# EAGLE design MoodBadge (EAGLE 8.1.0)
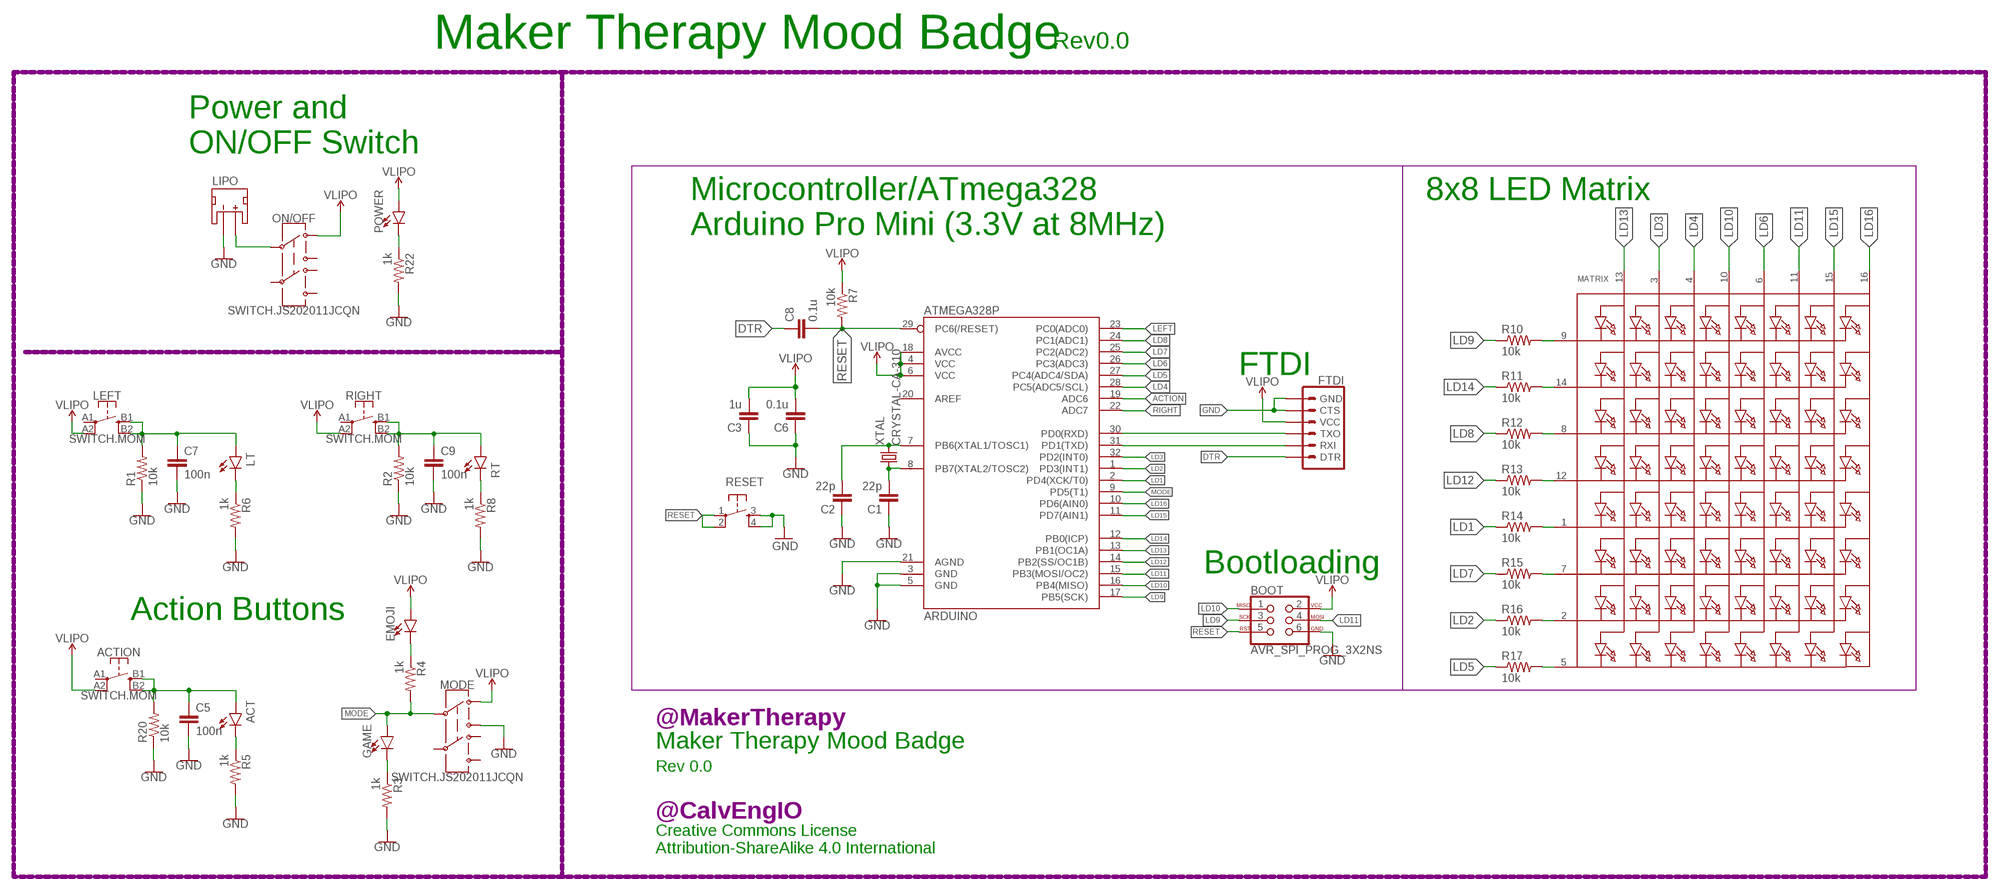
[diagram p0: schematic, sheet 1]

## Parts
ACT  LED0603  [LED-0603]
ACTION  SWITCH.MOM  [TACTILE_SWITCH_SMD_6.2MM_TALL]
ARDUINO  ATMEGA328P  ATMEGA328_SMT-OHMOD  [TQFP32-08]
BOOT  AVR_SPI_PROG_3X2NS  [2X3-NS]
C1  22p  CAPACITOR0402  [C0402]
C2  22p  CAPACITOR0402  [C0402]
C3  1u  CAPACITOR0402  [C0402]
C5  100n  CAPACITOR0402  [C0402]
C6  0.1u  CAPACITOR0402  [C0402]
C7  100n  CAPACITOR0402  [C0402]
C8  0.1u  C-EUC0402  [C0402]
C9  100n  CAPACITOR0402  [C0402]
EMOJI  LED0603  [LED-0603]
FTDI  6_PIN_SERIAL_TARGETSILK  [6_PIN_SERIAL_TARGET_SIDE_W_SILK]
GAME  LED0603  [LED-0603]
LEFT  SWITCH.MOM  [TACTILE_SWITCH_SMD_6.2MM_TALL]
LIPO  JST_2MM_MALE  [JST-2-SMD]
LT  LED0603  [LED-0603]
MATRIX  SEGMENT_8X8_ROWCATHODEM12A881UR  [SEGMENT_BL-M12A881UR]
MODE  SWITCH.JS202011JCQN  [SWITCH.00]
ON/OFF  SWITCH.JS202011JCQN  [SWITCH.00]
POWER  LED5MM  [LED_5MM]
R1  10k  RESISTOR0402  [R0402]
R2  10k  RESISTOR0402  [R0402]
R3  1k  RESISTOR0402  [R0402]
R4  1k  RESISTOR0402  [R0402]
R5  1k  RESISTOR0402  [R0402]
R6  1k  RESISTOR0402  [R0402]
R7  10k  RESISTOR0402  [R0402]
R8  1k  RESISTOR0402  [R0402]
R10  10k  RESISTOR0402  [R0402]
R11  10k  RESISTOR0402  [R0402]
R12  10k  RESISTOR0402  [R0402]
R13  10k  RESISTOR0402  [R0402]
R14  10k  RESISTOR0402  [R0402]
R15  10k  RESISTOR0402  [R0402]
R16  10k  RESISTOR0402  [R0402]
R17  10k  RESISTOR0402  [R0402]
R20  10k  RESISTOR0402  [R0402]
R22  1k  RESISTOR0402  [R0402]
RESET  BUTTON-PTS830GG140  [BUTTON-GULLWING]
RIGHT  SWITCH.MOM  [TACTILE_SWITCH_SMD_6.2MM_TALL]
RT  LED0603  [LED-0603]
U$8  CALVENGIO_HANDLEHANDLE.05  [CALVENGIO_HANDLE.05]
U$10  MAKERTHERAPY.HANDLEMAKERTHERAPY.HANDLE.175  [MAKERTHERAPY.HANDLE.175]
XTAL  CRYSTAL-CA-310  [CA-301]

## Nets
ACTION: ACT.A ACTION.B1 ACTION.B2 ARDUINO.19(ADC6) C5.1 R20.2
DTR: C8.1 FTDI.P$1(DTR)
GND: ARDUINO.3(GND) ARDUINO.5(GND) ARDUINO.21(AGND) BOOT.6 C1.1 C2.1 C3.1 C5.2 C6.1 C7.2 C9.2 FTDI.P$5(CTS) FTDI.P$6(GND) LIPO.1(-) MODE.3 R1.1 R2.1 R3.2 R5.2 R6.2 R8.2 R20.1 R22.2 RESET.3 RESET.4
LD1: ARDUINO.2(PD4(XCK/T0)) R14.1
LD2: ARDUINO.1(PD3(INT1)) R16.1
LD3: ARDUINO.32(PD2(INT0)) MATRIX.3(A2)
LD4: ARDUINO.28(PC5(ADC5/SCL)) MATRIX.4(A3)
LD5: ARDUINO.27(PC4(ADC4/SDA)) R17.1
LD6: ARDUINO.26(PC3(ADC3)) MATRIX.6(A5)
LD7: ARDUINO.25(PC2(ADC2)) R15.1
LD8: ARDUINO.24(PC1(ADC1)) R12.1
LD9: ARDUINO.17(PB5(SCK)) BOOT.3 R10.1
LD10: ARDUINO.16(PB4(MISO)) BOOT.1 MATRIX.10(A4)
LD11: ARDUINO.15(PB3(MOSI/OC2)) BOOT.4 MATRIX.11(A6)
LD12: ARDUINO.14(PB2(SS/OC1B)) R13.1
LD13: ARDUINO.13(PB1(OC1A)) MATRIX.13(A1)
LD14: ARDUINO.12(PB0(ICP)) R11.1
LD15: ARDUINO.11(PD7(AIN1)) MATRIX.15(A7)
LD16: ARDUINO.10(PD6(AIN0)) MATRIX.16(A8)
LEFT: ARDUINO.23(PC0(ADC0)) C7.1 LEFT.B1 LEFT.B2 LT.A R1.2
MODE: ARDUINO.9(PD5(T1)) GAME.A MODE.2 R4.2
N$1: ARDUINO.7(PB6(XTAL1/TOSC1)) C2.2 XTAL.2
N$2: ARDUINO.8(PB7(XTAL2/TOSC2)) C1.2 XTAL.1
N$3: POWER.K(C) R22.1
N$4: GAME.C R3.1
N$5: LIPO.2(+) ON/OFF.2
N$6: EMOJI.C R4.1
N$8: ACT.C R5.1
N$9: LT.C R6.1
N$10: R8.1 RT.C
N$16: MATRIX.9(K1) R10.2
N$17: MATRIX.14(K2) R11.2
N$18: MATRIX.8(K3) R12.2
N$19: MATRIX.12(K4) R13.2
N$20: MATRIX.1(K5) R14.2
N$21: MATRIX.7(K6) R15.2
N$22: MATRIX.2(K7) R16.2
N$23: MATRIX.5(K8) R17.2
RESET: ARDUINO.29(PC6(/RESET)) BOOT.5 C8.2 R7.2 RESET.1 RESET.2
RIGHT: ARDUINO.22(ADC7) C9.1 R2.2 RIGHT.B1 RIGHT.B2 RT.A
RXI/FTDI: ARDUINO.31(PD1(TXD)) FTDI.P$3(RXI)
TXO/FTDI: ARDUINO.30(PD0(RXD)) FTDI.P$2(TXO)
VLIPO: ACTION.A2 ARDUINO.4(VCC) ARDUINO.6(VCC) ARDUINO.18(AVCC) BOOT.2 C3.2 C6.2 EMOJI.A FTDI.P$4(VCC) LEFT.A2 MODE.1 ON/OFF.1 POWER.A R7.1 RIGHT.A2
Unconnected: ACTION.A1 ARDUINO.20(AREF) LEFT.A1 LIPO.NC1(PAD1) LIPO.NC2(PAD2) MODE.5 MODE.6 MODE.7 ON/OFF.3 ON/OFF.5 ON/OFF.6 ON/OFF.7 RIGHT.A1

## Notes on the sheet
- Maker Therapy Mood Badge | Rev0.0
- Power and
  ON/OFF Switch
- 8x8 LED Matrix
- Microcontroller/ATmega328
  Arduino Pro Mini (3.3V at 8MHz)
- FTDI
- Bootloading
- Action Buttons
- Maker Therapy Mood Badge
- Rev 0.0
- Creative Commons License
  Attribution-ShareAlike 4.0 International

## Library data of the parts
ACT EMOJI GAME LT POWER RT = CalvEngIO-LED:LED: LED (Generic) Standard schematic elements and footprints for 5mm, 3mm, 1206, and 0603 sized LEDs. Generic LEDs with no color specified.
ACTION LEFT RIGHT = CalvEngIO-Switches:SWITCH.MOM
ARDUINO = SparkFun-DigitalIC:ATMEGA328_SMT-OHMOD: 32-Pin Atmega328 part Commonly used on Arduino compatible boards Available in QFP and QFN packages TQFP is IC-09069 QFN is non-stock; PROD_ID: IC-09069
BOOT = CalvEngIO-Connectors:AVR_SPI_PROG_3X2: AVR ISP 6 Pin This is the reduced ISP connector for AVR programming. Common on Arduino. This footprint will take up less PCB space and can be used with a 10-pin to 6-pin adapter such as SKU: BOB-08508 **Special note about "TEST_POINT" package. The stop mask is on the top side, so if you want your programming test points to be on the bottom of your board, make sure to place this package on the bottom side of the board. This also ensure that the orientation to program from the bottom side will be correct. SparkFun Products: SparkFun ISP Pogo Adapter <https://www.sparkfun.com/products/11591> - NS Tiny AVR Programmer <https://www.sparkfun.com/products/11801> -PTH
C1-C3 C5-C7 C9 = CalvEngIO-Passives:CAPACITOR
C8 = resistor:C-EU: CAPACITOR, European symbol
FTDI = SparkFun-Connectors:6_PIN_SERIAL_TARGET: 6-pin header connection for use with the "FTDI BASIC" pinout - TARGET SIDE. Also known as "Arduino Serial Program Header". It is used to mate with our FTDI Basic serial programmers using the Arduino IDE. Note, this device has "TARGET" in the name. It is intended to be used on a design that contains a target micro-controller that you wish to program. The "sister" device, named "CABLE" is inteneded to be used on a design that usually lives on the end of your USB cable and prvides the converter chip (FTDI232 or FTDI231x) to commnicate serial RX/TX. You can populate with some of these: Break Away Headers - Straight <https://www.sparkfun.com/products/116> (PRT-00116) For reference (or to suit your programming needs) check out these designs: SparkFun FTDI Basic Breakout - 5V <https://www.sparkfun.com/products/9716> (DEV-09716) SparkFun FTDI Basic Breakout - 3.3V <https://www.sparkfun.com/products/9873> (DEV-09873) SparkFun FTDI SmartBasic <https://www.sparkfun.com/products/12935> (DEV-12935) SparkFun Beefy 3 - FTDI Basic Breakout <https://www.sparkfun.com/products/13746> (DEV-13746)
LIPO = CalvEngIO-Connectors:JST_2MM_MALE: JST 2MM MALE RA CONNECTOR Two pin, compact surface mount connector. Commonly used as a battery input connection point. We really like the solid locking feeling and high current rating on these small connectors. We use these all the time as battery connectors. Mates to single-cell LiPo batteries. Here is the connector we sell at SparkFun: JST Right Angle Connector - White <https://www.sparkfun.com/products/8612> (PRT-08612) Datasheet <http://www.sparkfun.com/datasheets/Prototyping/Connectors/JST-Horizontal.pdf> It was used on these SparkFun products: SparkFun MOSFET Power Controller <https://www.sparkfun.com/products/11214> (PRT-11214) SparkFun Battery Babysitter - LiPo Battery Manager <https://www.sparkfun.com/products/13777> (PRT-13777) And many, many others that required a lipo battery connection.; PROD_ID: CONN-11443; SF_ID: PRT-08612
MATRIX = adafruit:SEGMENT_8X8_ROWCATHODE: 8x8 LED Segment Displays: Row = Cathode 0.7" Red 8X8 Matrix, 1.9mm Round LEDs - BL-M07C881UR 1.2" Red 8x8 Matrix, 3.0mm Round LEDs - BL-M12A881UR 1.2" Red 8x8 Matrix, 3.0mm Square LEDs - BL-M12A883
MODE ON/OFF = CalvEngIO-Switches:SWITCH.JS202011JCQN
R1-R8 R10-R17 R20 R22 = CalvEngIO-Passives:RESISTOR
RESET = Orlando:BUTTON-PTS830GG140
U$8 = CalvEngIO-Logos:CALVENGIO_HANDLE
U$10 = CalvEngIO-Logos:MAKERTHERAPY.HANDLE
XTAL = OrlandoRonMod:CRYSTAL-CA-310

## Board
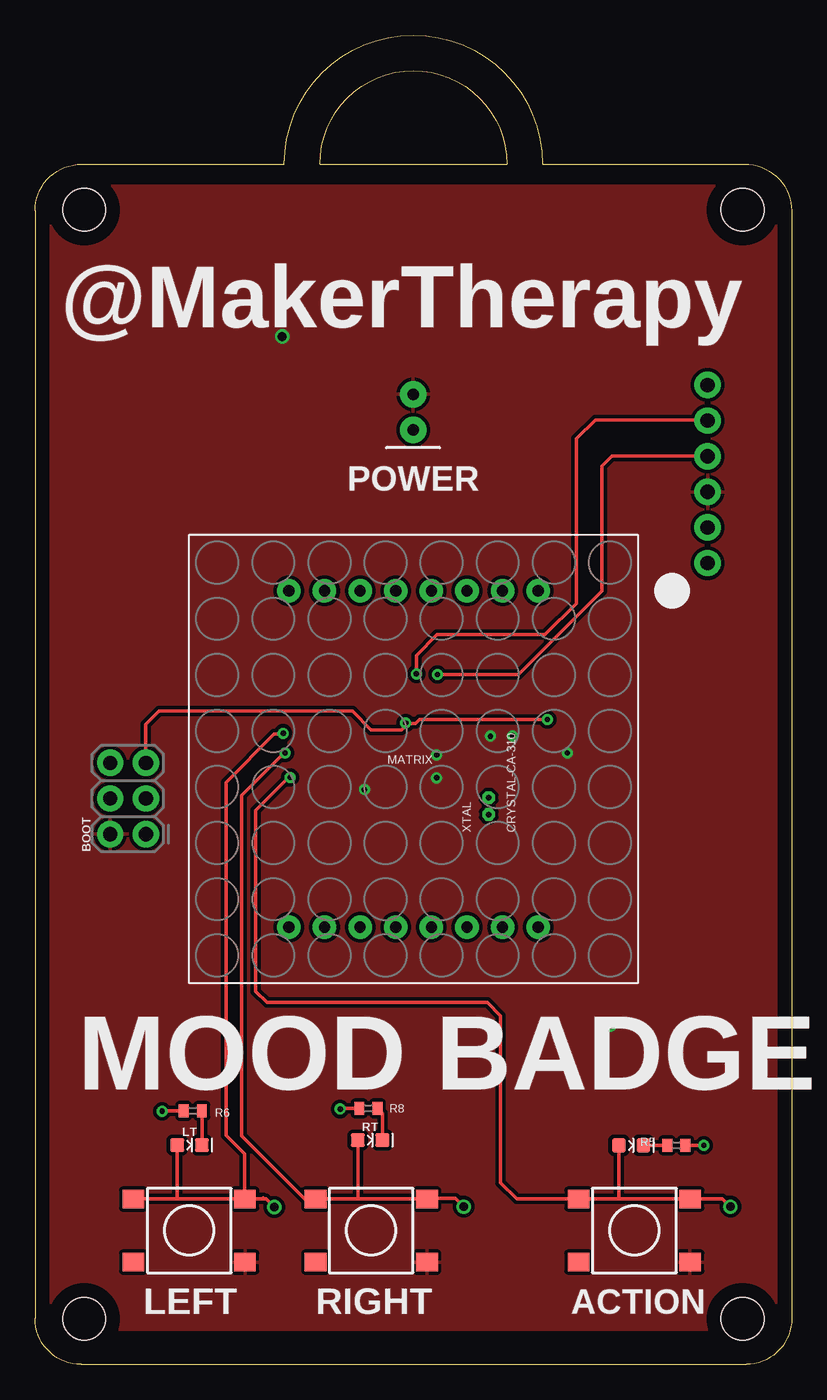
[diagram p1: board, top side]
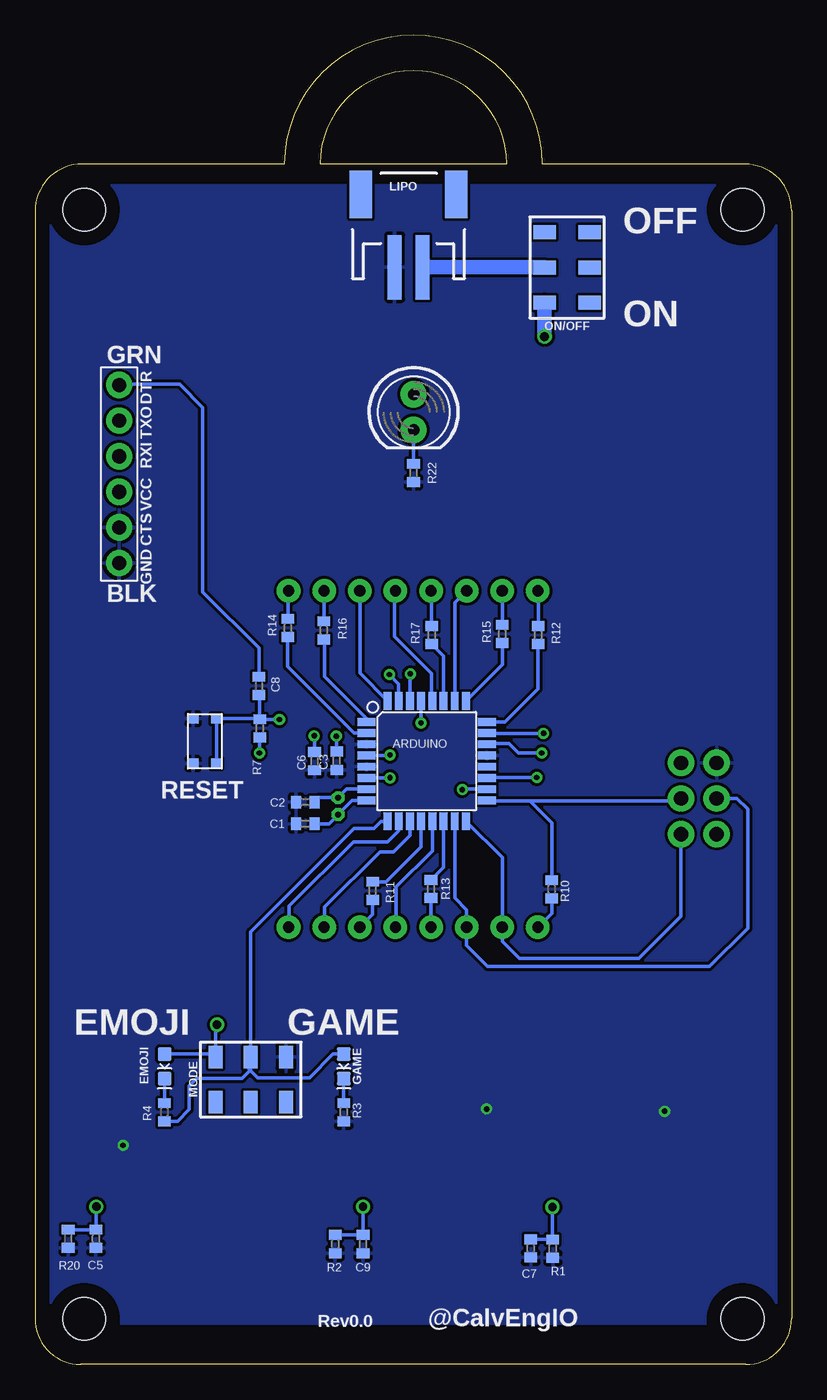
[diagram p2: board, bottom side, seen from below]

Size 53.98 x 94.81 mm. Coordinates in mm from the lower left corner, seen from the top.
Outline: 53.98,3.28 arc-90 50.72,0 3.28,0 arc-90 0,3.28 0,82.27 arc-90 3.33,85.6 17.78,85.6 arc-180 36.2,85.6 50.62,85.6 arc-90 53.98,82.27 53.98,3.33
Outline: 20.32,85.6 33.66,85.6 arc180 20.32,85.6
Copper layers (1*16): Top 0.035mm / dielectric 1.5mm / Bottom 0.035mm
Design rules "default": minimum track width 10mil, minimum drill 24mil, track to track 8mil, track to pad 8mil, pad to pad 8mil, via to via 8mil, smd to smd 8mil, copper to edge 40mil, drill to drill 8mil, minimum pad ring 10mil, minimum via ring 8mil, stop-mask expansion 4mil, vias tented up to drill 0mil, thermal gap 10mil
Holes 3.05 mm at 3.51,82.35 50.47,82.35 3.51,3.25 50.47,3.25

### Footprints (pad centres in the part's own frame; a part is rotated, then mirrored left to right if it is on the bottom)
LED-0603 = smd 1 x 1: A -0.877,0; C 0.877,0
TACTILE_SWITCH_SMD_6.2MM_TALL = smd 1.55 x 1.3: A1 -3.975,-2.25; A2 3.975,-2.25; B1 -3.975,2.25; B2 3.975,2.25
TQFP32-08 = smd 1.27 x 0.559: 1 -4.293,2.8; 2 -4.293,2; 3 -4.293,1.2; 4 -4.293,0.4; 5 -4.293,-0.4; 6 -4.293,-1.2; 7 -4.293,-2; 8 -4.293,-2.8; 17 4.293,-2.8; 18 4.293,-2; 19 4.293,-1.2; 20 4.293,-0.4; 21 4.293,0.4; 22 4.293,1.2; 23 4.293,2; 24 4.293,2.8 | smd 0.559 x 1.27: 9 -2.8,-4.293; 10 -2,-4.293; 11 -1.2,-4.293; 12 -0.4,-4.293; 13 0.4,-4.293; 14 1.2,-4.293; 15 2,-4.293; 16 2.8,-4.293; 25 2.8,4.293; 26 2,4.293; 27 1.2,4.293; 28 0.4,4.293; 29 -0.4,4.293; 30 -1.2,4.293; 31 -2,4.293; 32 -2.8,4.293
2X3-NS = drill 1.016 pad 1.88: 1 -2.54,-1.27; 2 -2.54,1.27; 3 0,-1.27; 4 0,1.27; 5 2.54,-1.27; 6 2.54,1.27
C0402 = smd 0.7 x 0.9: 1 -0.65,0; 2 0.65,0
6_PIN_SERIAL_TARGET_SIDE_W_SILK = drill 1.016 pad 1.88: P$1 -6.35,0; P$2 -3.81,0; P$3 -1.27,0; P$4 1.27,0; P$5 3.81,0; P$6 6.35,0
JST-2-SMD = smd 1 x 4.6: 1 -1,-3.7; 2 1,-3.7 | smd 1.6 x 3.4: NC1 -3.4,1.5; NC2 3.4,1.5
SEGMENT_BL-M12A881UR = drill 0.8 pad 1.676: 1 -8.89,-12; 2 -6.35,-12; 3 -3.81,-12; 4 -1.27,-12; 5 1.27,-12; 6 3.81,-12; 7 6.35,-12; 8 8.89,-12; 9 8.89,12; 10 6.35,12; 11 3.81,12; 12 1.27,12; 13 -1.27,12; 14 -3.81,12; 15 -6.35,12; 16 -8.89,12
SWITCH.00 = smd 1 x 1.6: 1 -2.5,1.6; 2 0,1.6; 3 2.5,1.6; 5 -2.5,-1.6; 6 0,-1.6; 7 2.5,-1.6
LED_5MM = drill 0.813 pad 1.88: A -1.27,0; K 1.27,0
R0402 = smd 0.7 x 0.9: 1 -0.65,0; 2 0.65,0
BUTTON-GULLWING = smd 0.7 x 0.75: 1 -1.6,0.825; 2 1.6,0.825; 3 -1.6,-0.825; 4 1.6,-0.825
CA-301 = drill 0.4 octagon: 1 0,0; 2 1.2,0

### Placement (x,y rotation side)
ACT  42.52,15.62 0 top
ACTION  42.75,9.55 0 top
ARDUINO  26.04,43.03 0 bottom
BOOT  6.63,40.36 90 top
C1  34.7,38.56 0 bottom
C2  34.7,40.11 0 bottom
C3  32.46,43.05 90 bottom
C5  49.63,8.97 270 bottom
C6  34.04,43.03 90 bottom
C7  18.62,8.28 270 bottom
C8  38,48.39 270 bottom
C9  30.58,8.59 270 bottom
EMOJI  44.73,21.26 270 bottom
FTDI  47.98,63.5 270 bottom
GAME  31.95,21.26 270 bottom
LEFT  11,9.55 0 top
LIPO  27.33,81.94 0 bottom
LT  11.02,15.65 0 top
MATRIX  27,43.18 180 top
MODE  38.58,20.32 0 bottom
ON/OFF  16.03,78.23 90 bottom
POWER  26.97,67.92 270 bottom
R1  17.04,8.26 90 bottom
R2  32.56,8.59 90 bottom
R3  31.95,17.98 270 bottom
R4  44.75,17.98 270 bottom
R5  45.75,15.62 0 top
R6  11.25,18.08 180 top
R7  37.95,45.36 90 bottom
R8  23.77,18.26 180 top
R10  17.12,33.88 270 bottom
R11  29.9,33.78 270 bottom
R12  18.08,52.02 90 bottom
R13  25.73,33.91 270 bottom
R14  35.94,52.53 90 bottom
R15  20.65,52.1 90 bottom
R16  33.38,52.35 90 bottom
R17  25.68,52.02 90 bottom
R20  51.61,8.97 90 bottom
R22  26.97,63.58 270 bottom
RESET  41.86,44.45 270 bottom
RIGHT  23.98,9.55 0 top
RT  23.9,16 0 top
U$8  20.88,2.69 0 bottom
U$10  24.69,73.94 0 top
XTAL  32.36,39.22 90 top

### Tracks (layer width: path | path; a pad name or v marks a point on that pad's centre or on a via)
ACTION  (via drill 0.38, 0.6)
  Top 0.254: v49.61,11.25 49.03,11.83 46.72,11.83 ACTION.B2 41.76,11.8 | v18.19,41.86 18.14,41.81 18.03,41.81 15.75,39.52 15.75,26.59 16.54,25.81 32.26,25.81 33.2,24.87 33.2,12.97 34.37,11.8 ACTION.B1 41.76,11.8 | 41.76,11.8 41.64,11.91 ACT.A
  Bottom 0.254: v49.61,11.25 49.61,9.64 C5.1 R20.2 | v18.19,41.86 21.71,41.86 ARDUINO.19
DTR
  Bottom 0.254: C8.1 38,51.08 42.01,55.09 42.01,68.25 43.66,69.9 47.92,69.9 FTDI.P$1
GND  (via drill 0.38)
  Top 0.254: R6.2 9.09,18.09 v9.07,18.06 | R8.2 21.82,18.26 v21.77,18.21 | R5.2 v47.7,15.62
  pour Bottom (isolate 0.203): 53.98,84.05 53.98,2.95 0,2.95 0,84.05
LD1
  Bottom 0.254: ARDUINO.2 31.21,45.03 35.97,49.78 35.97,51.85 R14.1
LD2
  Bottom 0.254: ARDUINO.1 30.33,46.08 33.33,49.07 33.33,51.65 R16.1
LD3
  Bottom 0.254: MATRIX.3 30.81,49.3 ARDUINO.32
LD4
  Bottom 0.254: ARDUINO.28 25.68,47.37 25.68,49.28 28.32,51.92 28.32,55.13 MATRIX.4
LD5
  Bottom 0.254: ARDUINO.27 24.84,50.52 R17.1
LD6
  Bottom 0.254: ARDUINO.26 24.04,54.34 MATRIX.6
LD7
  Bottom 0.254: R15.1 20.65,49.91 ARDUINO.25
LD8
  Bottom 0.254: ARDUINO.24 20.47,45.83 18.11,48.18 18.11,51.34 R12.1
LD9
  Bottom 0.254: R10.1 17.12,38.63 18.67,40.18 | 18.67,40.18 21.7,40.18 ARDUINO.17 | BOOT.3 8.08,40.18 18.67,40.18
LD10
  Bottom 0.254: ARDUINO.16 20.65,36.15 MATRIX.10 20.65,30.18 19.43,28.96 10.9,28.96 7.9,31.95 BOOT.1
LD11
  Bottom 0.254: ARDUINO.15 24.04,33.26 23.19,32.41 MATRIX.11 23.19,29.87 21.69,28.37 5.87,28.37 3.15,31.09 3.15,39.6 3.91,40.36 BOOT.4
LD12
  Bottom 0.254: ARDUINO.14 24.84,35.45 R13.1
LD13
  Bottom 0.254: MATRIX.13 28.25,31.2 28.25,31.85 28.22,31.88 28.22,34.04 25.64,36.62 ARDUINO.13
LD14
  Bottom 0.254: R11.1 29.88,34.42 28.93,34.42 26.43,36.91 ARDUINO.12
LD15
  Bottom 0.254: ARDUINO.11 27.23,37.74 28.41,36.56 29.38,36.56 33.33,32.61 33.33,31.2 MATRIX.15
LD16
  Bottom 0.254: ARDUINO.10 28.04,38.06 28.83,37.26 31.27,37.26 35.84,32.69 35.84,31.23 MATRIX.16
LEFT  (via drill 0.38, 0.6)
  Top 0.254: v17.07,11.23 16.47,11.83 16.2,11.83 | 15.52,11.83 16.2,11.83 | 15.52,11.83 14.97,11.83 LEFT.B2 14.94,11.84 14.94,15.04 13.62,16.35 13.62,41.51 17.07,44.96 17.65,44.96 v17.7,45.01 | 16.27,11.89 16.2,11.83 | 10.19,11.8 LEFT.B1 | 10.19,11.8 15.49,11.8 15.52,11.83 | LT.A 10.15,11.84 10.19,11.8
  Bottom 0.254: v17.07,11.23 17.07,8.93 | C7.1 17.07,8.93 | 17.07,8.93 R1.2 | v17.7,45.01 21.72,45.01 ARDUINO.23
MODE
  Bottom 0.254: ARDUINO.9 29.29,38.73 29.79,38.23 31.22,38.23 38.58,30.86 MODE.2 | GAME.A 32.7,22.14 34.39,20.45 38.1,20.45 38.71,21.06 38.71,21.79 MODE.2 | MODE.2 38.58,21.01 39.19,20.4 42.44,20.4 42.98,19.86 42.98,18.19 43.81,17.35 44.74,17.35 R4.2 | 38.61,21.95 MODE.2
N$1
  Bottom 0.254: ARDUINO.7 31.75,41.03 XTAL.2 33.73,40.42 C2.2
N$2
  Bottom 0.254: ARDUINO.8 31.35,40.23 XTAL.1 33.02,38.56 C1.2
N$3
  Bottom 0.254: POWER.K R22.1
N$4
  Bottom 0.254: GAME.C R3.1
N$5
  Bottom 1.016: LIPO.2 ON/OFF.2
N$6
  Bottom 0.254: EMOJI.C 44.73,18.66 R4.1
N$8
  Top 0.254: ACT.C R5.1
N$9
  Top 0.254: LT.C R6.1
N$10
  Top 0.254: R8.1 24.78,17.91 RT.C
N$16
  Bottom 0.254: R10.2 17.12,32.17 MATRIX.9
N$17
  Bottom 0.254: R11.2 29.9,32.09 MATRIX.14
N$18
  Bottom 0.254: R12.2 18.09,55.16 MATRIX.8
N$19
  Bottom 0.254: R13.2 MATRIX.12
N$20
  Bottom 0.254: R14.2 35.94,55.13 MATRIX.1
N$21
  Bottom 0.254: R15.2 MATRIX.7
N$22
  Bottom 0.254: R16.2 33.38,55.16 MATRIX.2
N$23
  Bottom 0.254: R17.2 25.68,55.13 MATRIX.5
RESET  (via drill 0.38)
  Top 0.254: BOOT.5 7.9,45.64 8.84,46.58 22.66,46.58 23.98,45.26 26.14,45.26 26.42,45.54 26.42,45.72 | 26.42,45.72 v26.44,45.74 | v36.55,46 27.43,46 27.13,45.7 26.44,45.7 26.42,45.72
  Bottom 0.254: v26.44,45.74 ARDUINO.29 | 36.64,46.09 v36.55,46 37.93,46 R7.2 | R7.2 37.95,47.69 C8.2 | R7.2 37.98,46.05 RESET.1 RESET.2
RIGHT  (via drill 0.38, 0.6)
  Top 0.254: v30.58,11.25 29.98,11.85 27.95,11.85 RIGHT.B2 23.09,11.8 | v17.83,43.61 17.78,43.61 14.73,40.56 14.73,16.31 19.24,11.8 RIGHT.B1 23.09,11.8 | RT.A 23.02,11.87 23.09,11.8
  Bottom 0.254: v30.58,11.25 C9.1 R2.2 | v17.83,43.61 19.51,43.61 20.17,44.27 21.7,44.27 ARDUINO.22
RXI/FTDI  (via drill 0.38)
  Top 0.254: v28.7,49.2 34.47,49.2 40.44,55.17 40.44,64.08 41.15,64.8 47.95,64.8 FTDI.P$3
  Bottom 0.254: ARDUINO.31 28.04,48.53 v28.7,49.2
TXO/FTDI  (via drill 0.38)
  Top 0.254: v27.2,49.25 27.2,50.57 28.68,52.05 36.37,52.05 38.61,54.28 38.61,66.02 39.95,67.36 47.92,67.36 FTDI.P$2
  Bottom 0.254: ARDUINO.30 27.23,49.22 v27.2,49.25
VLIPO  (via drill 0.38, 0.6, 0.64)
  Bottom 0.254: ARDUINO.18 23.26,41.03 v23.5,41 | ARDUINO.6 28.81,41.83 v28.65,41.83 | ARDUINO.4 28.89,43.43 v28.65,43.46 | v41,24.23 41.08,24.14 MODE.1 41.3,22.14 EMOJI.A | C6.2 34.04,44.81 v34.06,44.83 | C3.2 32.46,44.78 v32.49,44.81 | R7.1 37.95,43.64 v37.97,43.61
  Bottom 1.016: ON/OFF.1 v17.63,73.31 v17.63,73.3
  pour Top (isolate 0.254): 0,84.05 53.98,84.05 53.98,2.46 0,2.46

### Text on the board
tPlace: MOOD BADGE
bPlace: OFF | ON | GAME | EMOJI | Rev0.0